# Altium project step_moter.PrjPcb
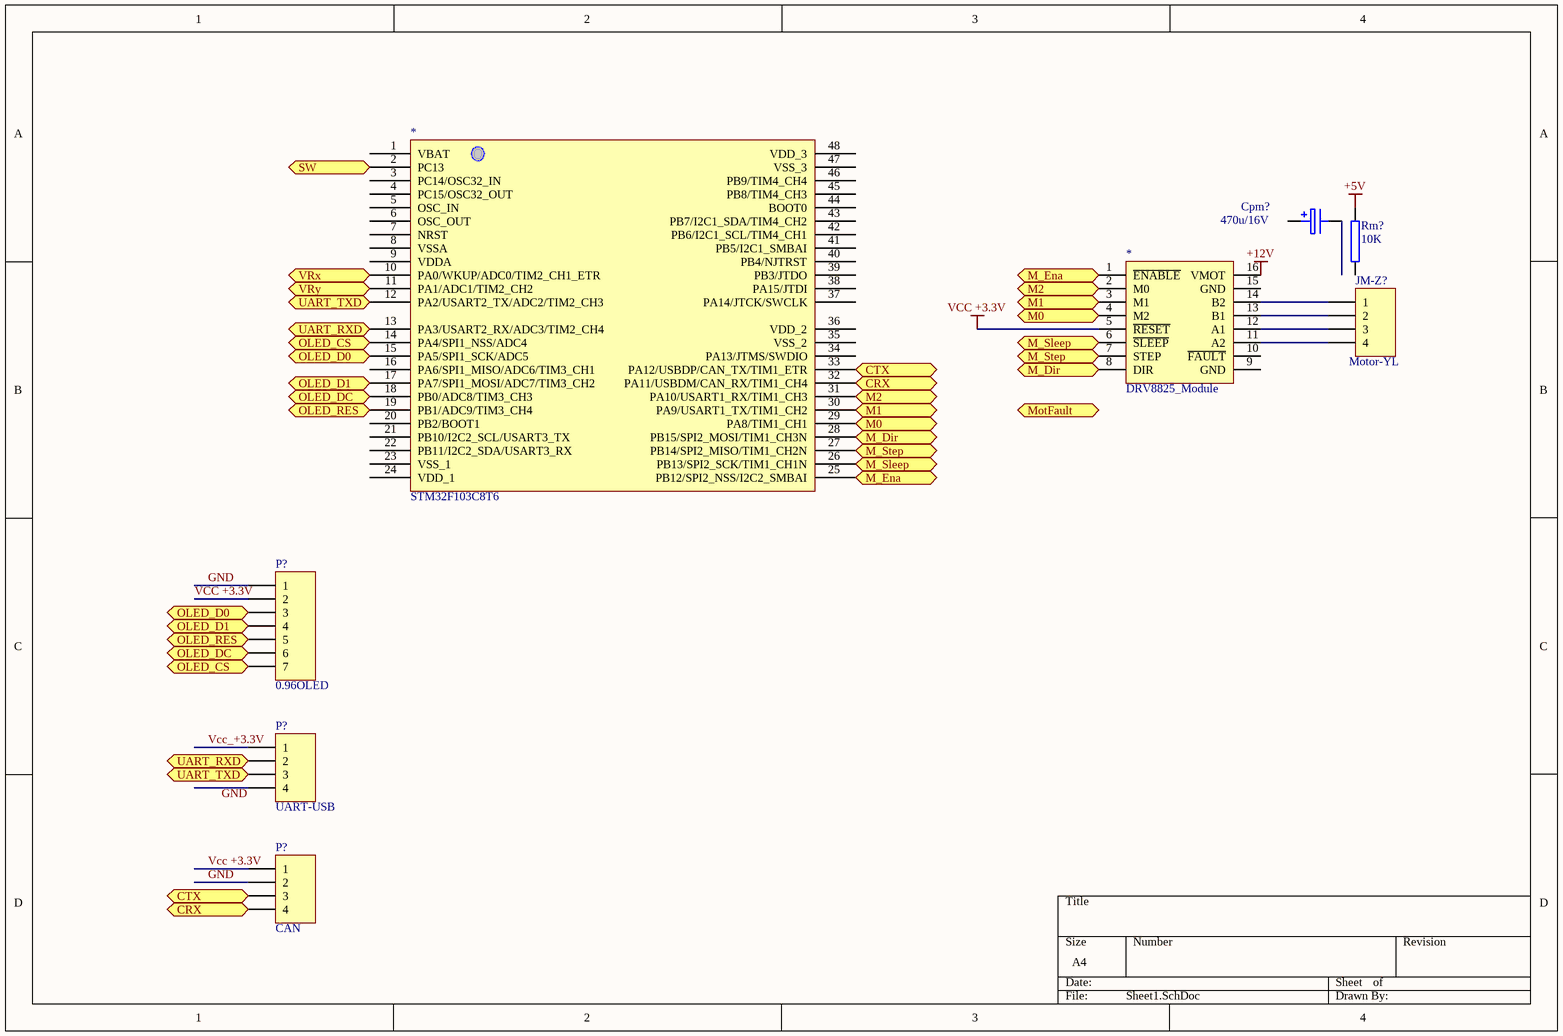
[diagram p0: Sheet1.SchDoc]
3 sheets, 135 parts. Net scope: flat (ports and power ports of the same name join across sheets).
Board files: V0.0.PcbDoc, V0.1.PcbDoc, ZJ-20251206.PcbDoc
Sheets:
  Sheet1.SchDoc
  V0.0.SchDoc
  V0.1.SchDoc

## Sheet Sheet1.SchDoc
size A4

### Parts
(Parts that share a designator on the sheet are numbered #1, #2 ... from top to bottom, then left to right.)
*#1  STM32F103C8T6
*#2  DRV8825_Module
Cpm?  470u/16V
JM-Z?  Motor-YL  [HDR1X4]
P?#1  0.96OLED  [HDR1X7]
P?#2  UART-USB  [HDR1X4]
P?#3  CAN  [HDR1X4]
Rm?  10K

### Ports
CRX (in), CRX (out), CTX (in), CTX (out), M0 (out), M1 (out), M2 (out), M_Dir (in), M_Dir (out), M_Ena (in), M_Ena (out), M_Sleep (in), M_Sleep (out), M_Step (in), M_Step (out), MotFault (out), OLED_CS (in), OLED_CS (out), OLED_D0 (in), OLED_D0 (out), OLED_D1 (in), OLED_D1 (out), OLED_DC (in), OLED_DC (out), OLED_RES (in), OLED_RES (out), SW (in), UART_RXD (in), UART_RXD (out), UART_TXD (in), UART_TXD (out), VRx (in), VRy (in)

### Nets
+5V: Rm?.1
+12V: *#2.16(VMOT)
VCC +3.3V: *#2.5(~{RESET}) P?#1.2 P?#3.1
GND: P?#1.1 P?#3.2
Vcc_+3.3V: P?#2.1
Net*#1_2: *#1.2(PC13) ; port SW
Net*#1_10: *#1.10(PA0/WKUP/ADC0/TIM2_CH1_ETR) ; port VRx
Net*#1_11: *#1.11(PA1/ADC1/TIM2_CH2) ; port VRy
Net*#1_12: *#1.12(PA2/USART2_TX/ADC2/TIM2_CH3) P?#2.3 ; port UART_TXD
Net*#1_13: *#1.13(PA3/USART2_RX/ADC3/TIM2_CH4) P?#2.2 ; port UART_RXD
Net*#1_14: *#1.14(PA4/SPI1_NSS/ADC4) P?#1.7 ; port OLED_CS
Net*#1_15: *#1.15(PA5/SPI1_SCK/ADC5) P?#1.3 ; port OLED_D0
Net*#1_17: *#1.17(PA7/SPI1_MOSI/ADC7/TIM3_CH2) P?#1.4 ; port OLED_D1
Net*#1_18: *#1.18(PB0/ADC8/TIM3_CH3) P?#1.6 ; port OLED_DC
Net*#1_19: *#1.19(PB1/ADC9/TIM3_CH4) P?#1.5 ; port OLED_RES
Net*#1_25: *#1.25(PB12/SPI2_NSS/I2C2_SMBAI) *#2.1(~{ENABLE}) ; port M_Ena
Net*#1_26: *#1.26(PB13/SPI2_SCK/TIM1_CH1N) *#2.6(~{SLEEP}) ; port M_Sleep
Net*#1_27: *#1.27(PB14/SPI2_MISO/TIM1_CH2N) *#2.7(STEP) ; port M_Step
Net*#1_28: *#1.28(PB15/SPI2_MOSI/TIM1_CH3N) *#2.8(DIR) ; port M_Dir
Net*#1_29: *#1.29(PA8/TIM1_CH1) *#2.4(M2) ; port M0
Net*#1_30: *#1.30(PA9/USART1_TX/TIM1_CH2) *#2.3(M1) ; port M1
Net*#1_31: *#1.31(PA10/USART1_RX/TIM1_CH3) *#2.2(M0) ; port M2
Net*#1_32: *#1.32(PA11/USBDM/CAN_RX/TIM1_CH4) P?#3.4 ; port CRX
Net*#1_33: *#1.33(PA12/USBDP/CAN_TX/TIM1_ETR) P?#3.3 ; port CTX
Net*#2_11: *#2.11(A2) JM-Z?.4
Net*#2_12: *#2.12(A1) JM-Z?.3
Net*#2_13: *#2.13(B1) JM-Z?.2
Net*#2_14: *#2.14(B2) JM-Z?.1

Not connected (* = marked no-connect by the designer): *#1 1(VBAT) 3(PC14/OSC32_IN) 4(PC15/OSC32_OUT) 5(OSC_IN) 6(OSC_OUT) 7(NRST) 8(VSSA) 9(VDDA) 16(PA6/SPI1_MISO/ADC6/TIM3_CH1) 20(PB2/BOOT1) 21(PB10/I2C2_SCL/USART3_TX) 22(PB11/I2C2_SDA/USART3_RX) 23(VSS_1) 24(VDD_1) 34(PA13/JTMS/SWDIO) 35(VSS_2) 36(VDD_2) 37(PA14/JTCK/SWCLK) 38(PA15/JTDI) 39(PB3/JTDO) 40(PB4/NJTRST) 41(PB5/I2C1_SMBAI) 42(PB6/I2C1_SCL/TIM4_CH1) 43(PB7/I2C1_SDA/TIM4_CH2) 44(BOOT0) 45(PB8/TIM4_CH3) 46(PB9/TIM4_CH4) 47(VSS_3) 48(VDD_3); *#2 9(GND) 10(~{FAULT}) 15(GND); Cpm? 1 2; P?#2 4; Rm? 2

### Notes on the sheet
- Labels drawn without touching a wire or pin: GND

### Library data of the parts
Cpm? = ELECTRO1: Electrolytic Capacitor
JM-Z? P?#2 P?#3 = Header 4: Header, 4-Pin; LatestRevisionDate: 17-Jul-2002; LatestRevisionNote: Re-released for DXP Platform.; Publisher: Altium Limited
P?#1 = Header 7: Header, 7-Pin; LatestRevisionDate: 17-Jul-2002; LatestRevisionNote: Re-released for DXP Platform.; Publisher: Altium Limited
Rm? = RES2

## Sheet V0.0.SchDoc
size A4
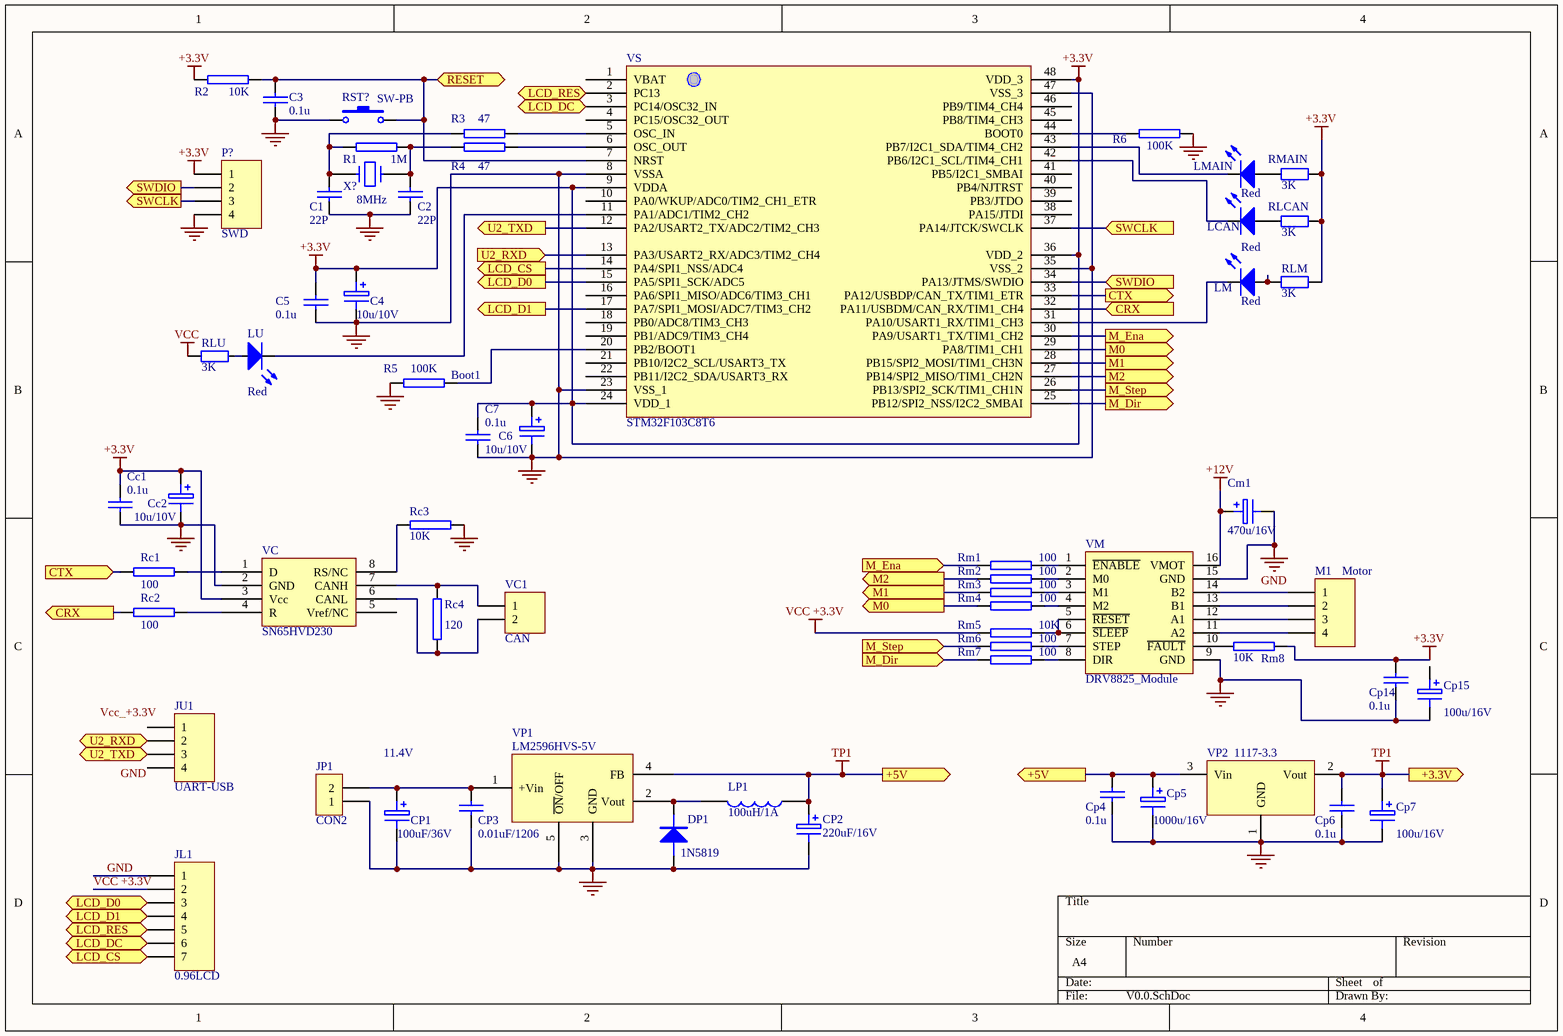
[diagram p1: V0.0.SchDoc]

### Parts
(Parts that share a designator on the sheet are numbered #1, #2 ... from top to bottom, then left to right.)
C1#1  22P
C2#1  22P
C3#1  0.1u
C4#1  10u/10V
C5#1  0.1u
C6#1  10u/10V
C7#1  0.1u
Cc1  0.1u
Cc2  10u/10V
Cm1  470u/16V
CP1  100uF/36V
CP2  220uF/16V
CP3  0.01uF/1206
Cp4  0.1u
Cp5  1000u/16V
Cp6  0.1u
Cp7  100u/16V
Cp14#1  0.1u
Cp15#1  100u/16V
DP1  1N5819
JL1  0.96LCD  [HDR1X7]
JP1  CON2
JU1  UART-USB  [HDR1X4]
LCAN  Red  [LED-0]
LM  Red  [LED-0]
LMAIN#1  Red  [LED-0]
LP1  100uH/1A
LU  Red  [LED-0]
M1  Motor  [HDR1X4]
P?#4  SWD  [HDR1X4]
R1#1  1M
R2#1  10K
R3#1  47
R4#1  47
R5#1  100K
R6#1  100K
Rc1#1  100
Rc2#1  100
Rc3#1  10K
Rc4#1  120
RLCAN  value 3K  [AXIAL-0.4]  (hidden comment: Res2)
RLM  value 3K  [AXIAL-0.4]  (hidden comment: Res2)
RLU  value 3K  [AXIAL-0.4]  (hidden comment: Res2)
Rm1#1  100
Rm2#1  100
Rm3#1  100
Rm4#1  100
Rm5#1  10K
Rm6#1  100
Rm7#1  100
Rm8#1  10K
RMAIN  value 3K  [AXIAL-0.4]  (hidden comment: Res2)
RST?  SW-PB  [SPST-2]
VC  SN65HVD230
VC1  CAN  [HDR1X2]
VM  DRV8825_Module
VP1  LM2596HVS-5V
VP2  1117-3.3
VS  STM32F103C8T6
X?  8MHz

### Ports
+3.3V, +5V (out), CRX (in), CRX (out), CTX (in), CTX (out), LCD_CS (in), LCD_CS (out), LCD_D0 (in), LCD_D0 (out), LCD_D1 (in), LCD_D1 (out), LCD_DC (in), LCD_DC (out), LCD_RES (in), LCD_RES (out), M0 (out), M1 (out), M2 (out), M_Dir (in), M_Dir (out), M_Ena (in), M_Ena (out), M_Step (in), M_Step (out), RESET, SWCLK (in), SWCLK (out), SWDIO (in), SWDIO (out), U2_RXD (in), U2_RXD (out), U2_TXD (in), U2_TXD (out)

### Nets
+3.3V: C4#1.1 C5#1.1 C6#1.1 C7#1.1 Cc1.1 Cc2.1 CP2.1 Cp4.1 Cp5.1 Cp6.1 Cp7.1 Cp14#1.1 LP1.1 P?#4.1 R2#1.2 RLCAN.1 RLM.1 Rm8#1.1 RMAIN.1 VC.3(Vcc) VP1.4(FB) VP2.2(Vout) VP2.3(Vin) VS.9(VDDA) VS.24(VDD_1) VS.36(VDD_2) VS.48(VDD_3) ; port +3.3V, port +5V  [also labelled TP1]
+12V: Cm1.1 VM.16(VMOT)
GND: C1#1.1 C2#1.1 C3#1.1 C4#1.2 C5#1.2 C6#1.2 C7#1.2 Cc1.2 Cc2.2 Cm1.2 Cp4.2 Cp5.2 Cp6.2 Cp7.2 JL1.1 P?#4.4 R5#1.2 R6#1.1 Rc3#1.2 RST?.1 VC.2(GND) VM.15(GND) VP2.1(GND) VS.8(VSSA) VS.23(VSS_1) VS.35(VSS_2) VS.47(VSS_3)
NetCp14#1_2: Cp14#1.2 Cp15#1.2 VM.9(GND)
VCC: CP1.2 CP2.2 CP3.2 DP1.1(A) JP1.1 RLU.2 VP1.3(GND) VP1.5(~{ON}/OFF)
VCC +3.3V: JL1.2 Rm5#1.1
Net*#1_25: Rm1#1.1 VS.30(PA9/USART1_TX/TIM1_CH2) ; port M_Ena
Net*#1_27: Rm6#1.1 VS.26(PB13/SPI2_SCK/TIM1_CH1N) ; port M_Step
Net*#1_28: Rm7#1.1 VS.25(PB12/SPI2_NSS/I2C2_SMBAI) ; port M_Dir
Net*#1_29: Rm4#1.1 VS.29(PA8/TIM1_CH1) ; port M0
Net*#1_30: Rm3#1.1 VS.28(PB15/SPI2_MOSI/TIM1_CH3N) ; port M1
Net*#1_31: Rm2#1.1 VS.27(PB14/SPI2_MISO/TIM1_CH2N) ; port M2
Net*#1_32: Rc2#1.1 VS.32(PA11/USBDM/CAN_RX/TIM1_CH4) ; port CRX
Net*#1_33: Rc1#1.1 VS.33(PA12/USBDP/CAN_TX/TIM1_ETR) ; port CTX
NetC1#1_2: C1#1.2 R1#1.2 R3#1.2 X?.1
NetC2#1_2: C2#1.2 R1#1.1 R4#1.2 X?.2
NetC3#1_2: C3#1.2 R2#1.1 RST?.2 VS.7(NRST) ; port RESET
NetCP1_1: CP1.1 CP3.1 JP1.2 VP1.1(+Vin)
NetDP1_2: DP1.2(K) LP1.2 VP1.2(Vout)
NetJL1_3: JL1.3 VS.15(PA5/SPI1_SCK/ADC5) ; port LCD_D0
NetJL1_4: JL1.4 VS.17(PA7/SPI1_MOSI/ADC7/TIM3_CH2) ; port LCD_D1
NetJL1_5: JL1.5 VS.2(PC13) ; port LCD_RES
NetJL1_6: JL1.6 VS.3(PC14/OSC32_IN) ; port LCD_DC
NetJL1_7: JL1.7 VS.14(PA4/SPI1_NSS/ADC4) ; port LCD_CS
NetJU1_2: JU1.2 VS.13(PA3/USART2_RX/ADC3/TIM2_CH4) ; port U2_RXD
NetJU1_3: JU1.3 VS.12(PA2/USART2_TX/ADC2/TIM2_CH3) ; port U2_TXD
NetLCAN_1: LCAN.1(A) RLCAN.2
NetLCAN_2: LCAN.2(K) VS.42(PB6/I2C1_SCL/TIM4_CH1)
NetLM_1: LM.1(A) RLM.2
NetLM_2: LM.2(K) VS.31(PA10/USART1_RX/TIM1_CH3)
NetLMAIN#1_1: LMAIN#1.1(A) RMAIN.2
NetLMAIN#1_2: LMAIN#1.2(K) VS.43(PB7/I2C1_SDA/TIM4_CH2)
NetLU_1: LU.1(A) RLU.1
NetLU_2: LU.2(K) VS.11(PA1/ADC1/TIM2_CH2)
NetM1_1: M1.1 VM.14(B2)
NetM1_2: M1.2 VM.13(B1)
NetM1_3: M1.3 VM.12(A1)
NetM1_4: M1.4 VM.11(A2)
NetP?#4_2: P?#4.2 VS.34(PA13/JTMS/SWDIO) ; port SWDIO
NetP?#4_3: P?#4.3 VS.37(PA14/JTCK/SWCLK) ; port SWCLK
NetR3#1_1: R3#1.1 VS.5(OSC_IN)
NetR4#1_1: R4#1.1 VS.6(OSC_OUT)
NetR5#1_1: R5#1.1 VS.20(PB2/BOOT1)
NetR6#1_2: R6#1.2 VS.44(BOOT0)
NetRc1#1_2: Rc1#1.2 VC.1(D)
NetRc2#1_2: Rc2#1.2 VC.4(R)
NetRc3#1_1: Rc3#1.1 VC.8(RS/NC)
NetRc4#1_1: Rc4#1.1 VC.7(CANH) VC1.1
NetRc4#1_2: Rc4#1.2 VC.6(CANL) VC1.2
NetRm1#1_2: Rm1#1.2 VM.1(~{ENABLE})
NetRm2#1_2: Rm2#1.2 VM.2(M0)
NetRm3#1_2: Rm3#1.2 VM.3(M1)
NetRm4#1_2: Rm4#1.2 VM.4(M2)
NetRm5#1_2: Rm5#1.2 VM.5(~{RESET}) VM.6(~{SLEEP})
NetRm6#1_2: Rm6#1.2 VM.7(STEP)
NetRm7#1_2: Rm7#1.2 VM.8(DIR)
NetRm8#1_2: Rm8#1.2 VM.10(~{FAULT})

Not connected (* = marked no-connect by the designer): Cp15#1 1; JU1 1 4; VC 5(Vref/NC); VS 1(VBAT) 4(PC15/OSC32_OUT) 10(PA0/WKUP/ADC0/TIM2_CH1_ETR) 16(PA6/SPI1_MISO/ADC6/TIM3_CH1) 18(PB0/ADC8/TIM3_CH3) 19(PB1/ADC9/TIM3_CH4) 21(PB10/I2C2_SCL/USART3_TX) 22(PB11/I2C2_SDA/USART3_RX) 38(PA15/JTDI) 39(PB3/JTDO) 40(PB4/NJTRST) 41(PB5/I2C1_SMBAI) 45(PB8/TIM4_CH3) 46(PB9/TIM4_CH4)

### Notes on the sheet
- (near R5#1) Boot1
- 11.4V
- Labels drawn without touching a wire or pin: GND, Vcc_+3.3V

### Library data of the parts
C1#1 C2#1 C3#1 C5#1 C7#1 Cc1 CP3 Cp4 Cp6 Cp14#1 = CAP: Capacitor
C4#1 C6#1 Cc2 Cm1 CP1 CP2 Cp5 Cp7 Cp15#1 = ELECTRO1: Electrolytic Capacitor
DP1 = DIODE
JL1 = Header 7: Header, 7-Pin; LatestRevisionDate: 17-Jul-2002; LatestRevisionNote: Re-released for DXP Platform.; Publisher: Altium Limited
JP1 = CON2: Connector
JU1 M1 P?#4 = Header 4: Header, 4-Pin; LatestRevisionDate: 17-Jul-2002; LatestRevisionNote: Re-released for DXP Platform.; Publisher: Altium Limited
LCAN LM LMAIN#1 LU = LED0: Typical INFRARED GaAs LED; Published: 8-Jun-2000; LatestRevisionDate: 08-Jul-2005; LatestRevisionNote: Mech Layer 1 removed.; PackageReference: LED-0; Publisher: Altium Limited
LP1 = INDUCTOR1
R1#1 R2#1 R3#1 R4#1 R5#1 R6#1 Rc1#1 Rc2#1 Rc3#1 Rc4#1 Rm1#1 Rm2#1 Rm3#1 Rm4#1 Rm5#1 Rm6#1 Rm7#1 Rm8#1 = RES2
RLCAN RLM RLU RMAIN = Res2: Resistor; Published: 8-Jun-2000; LatestRevisionDate: 17-Jul-2002; LatestRevisionNote: Re-released for DXP Platform.; PackageReference: AXIAL-0.4; Publisher: Altium Limited
RST? = SW-PB: Switch; Published: 24-Mar-1999; LatestRevisionDate: 17-Jul-2002; LatestRevisionNote: Re-released for DXP Platform.; PackageReference: SPST-2; Publisher: Altium Limited
VC1 = Header 2: Header, 2-Pin; LatestRevisionDate: 17-Jul-2002; LatestRevisionNote: Re-released for DXP Platform.; Publisher: Altium Limited
X? = CRYSTAL

## Sheet V0.1.SchDoc
size A3
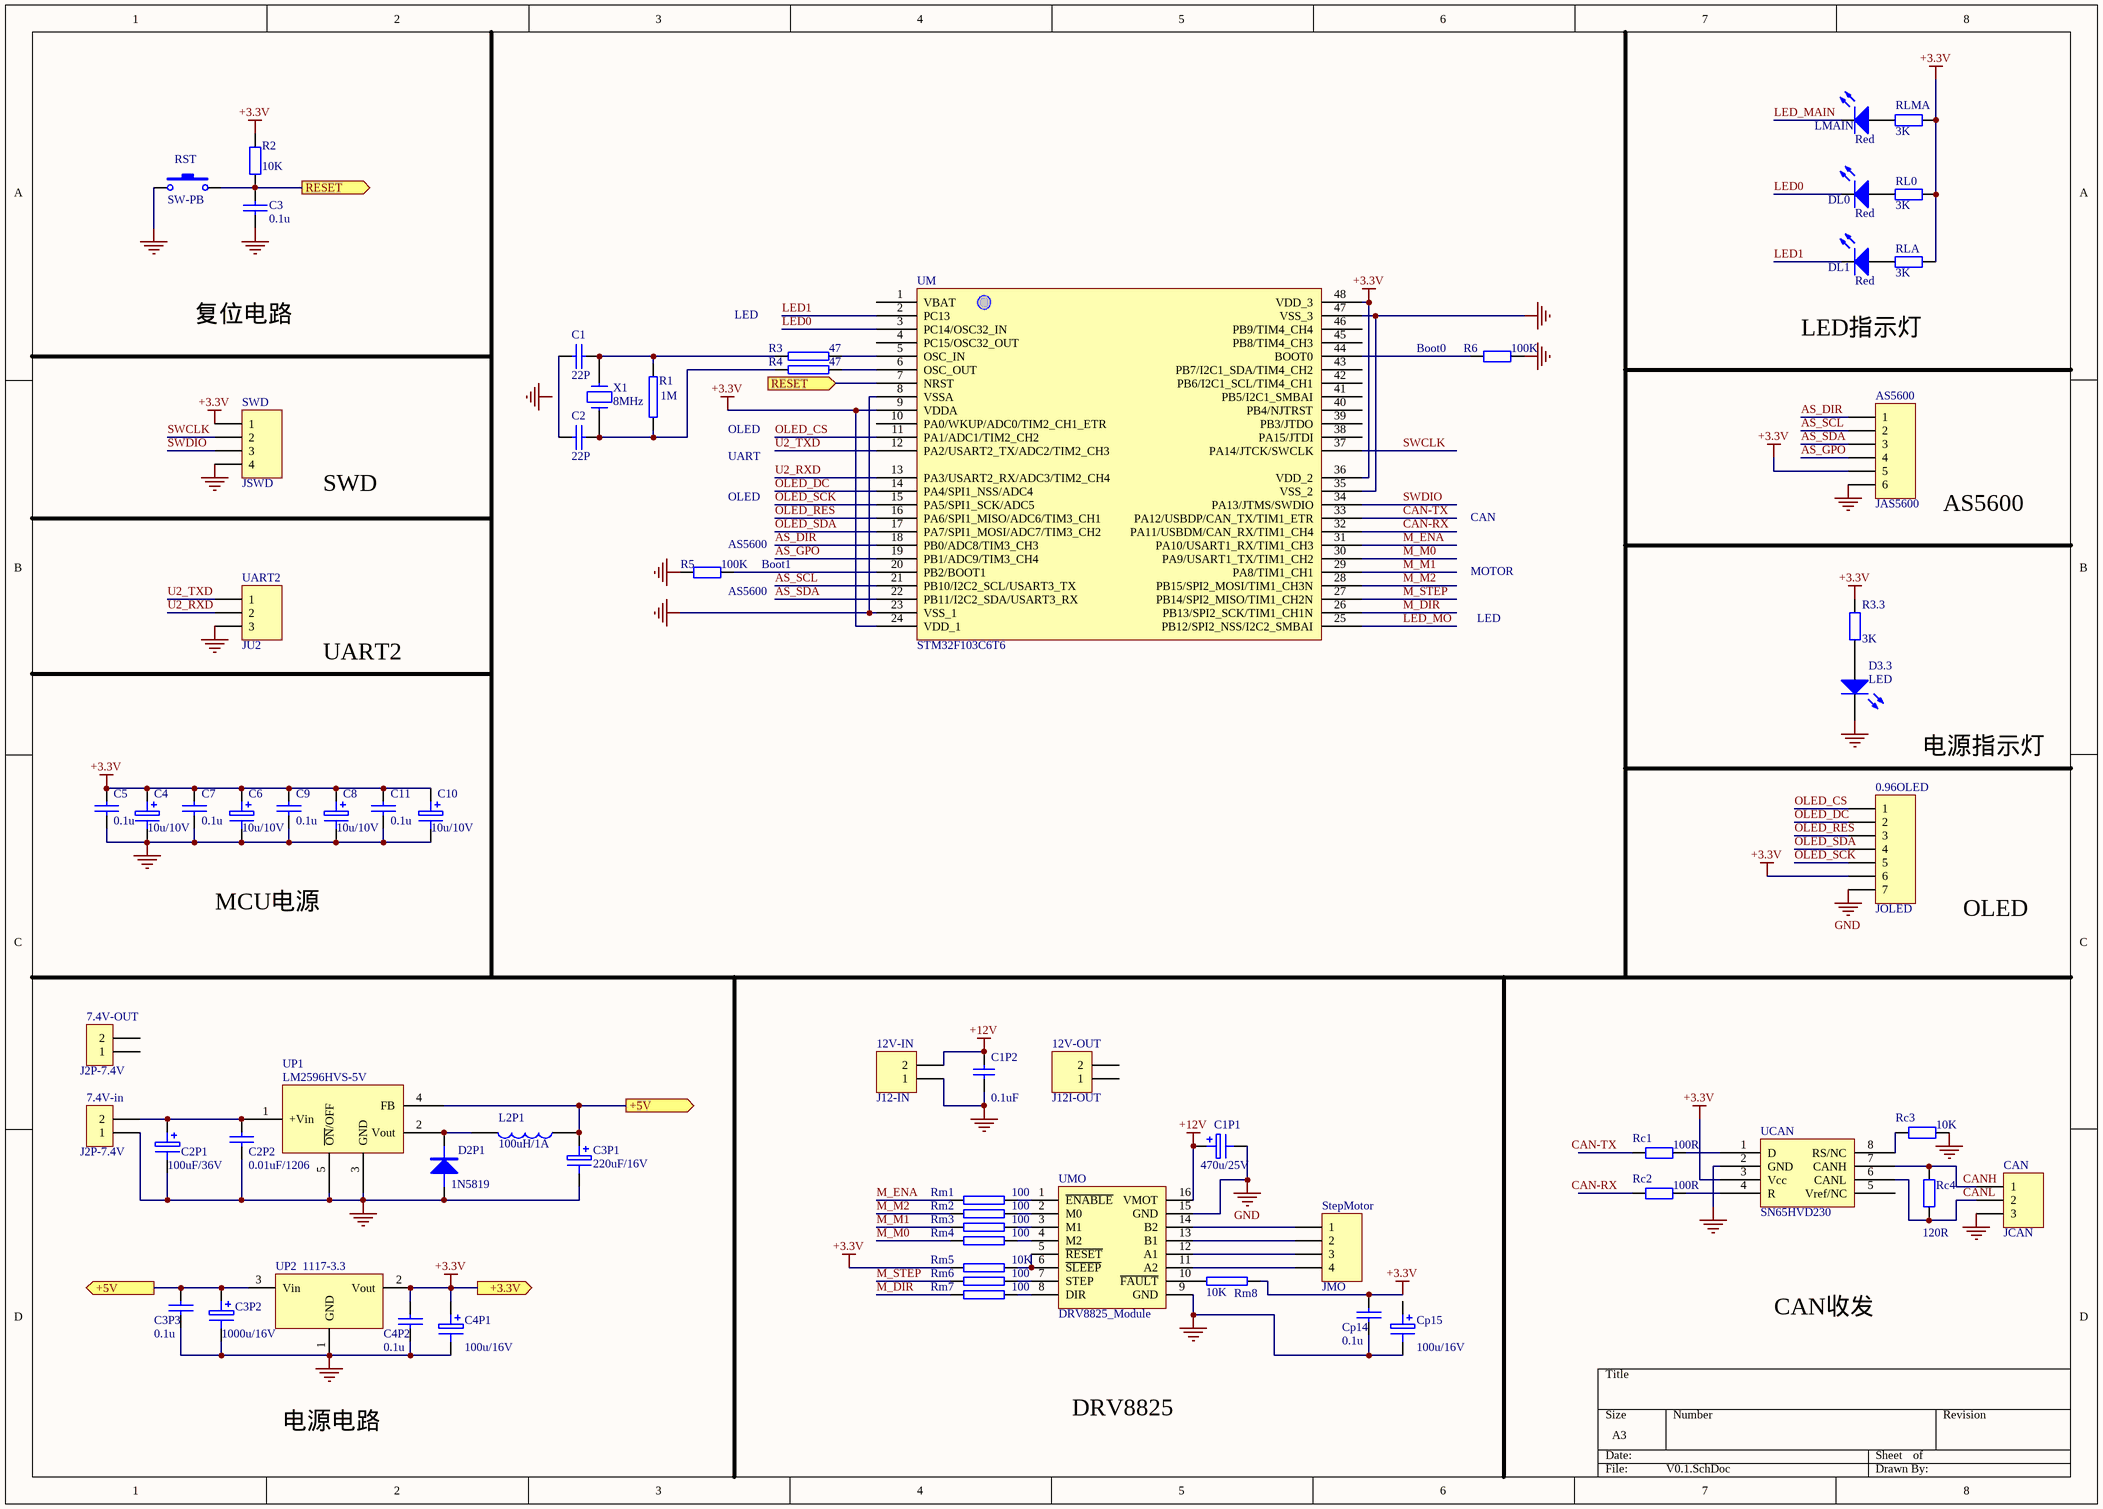
[diagram p2: V0.1.SchDoc]

### Parts
(Parts that share a designator on the sheet are numbered #1, #2 ... from top to bottom, then left to right.)
0.96OLED  JOLED  [HDR1X7]
7.4V-in  J2P-7.4V
7.4V-OUT  J2P-7.4V
12V-IN  J12-IN  [HDR1X2]
12V-OUT  J12I-OUT  [HDR1X2]
AS5600  JAS5600  [HDR1X6]
C1#2  22P
C1P1  470u/25V
C1P2  value 0.1uF  [C1206]  (hidden comment: Cap Semi)
C2#2  22P
C2P1  100uF/36V
C2P2  0.01uF/1206
C3#2  0.1u
C3P1  220uF/16V
C3P2  1000u/16V
C3P3  0.1u
C4#2  10u/10V
C4P1  100u/16V
C4P2  0.1u
C5#2  0.1u
C6#2  10u/10V
C7#2  0.1u
C8  10u/10V
C9  0.1u
C10  10u/10V
C11  0.1u
CAN  JCAN  [HDR1X3]
Cp14#2  0.1u
Cp15#2  100u/16V
D2P1  1N5819
D3.3  LED  [3.2X1.6X1.1]
DL0  Red  [LED-0]
DL1  Red  [LED-0]
L2P1  100uH/1A
LMAIN#2  Red  [LED-0]
R1#2  1M
R2#2  10K  [AXIAL-0.4]
R3#2  47
R3.3  value 3K  [AXIAL-0.4]  (hidden comment: Res2)
R4#2  47
R5#2  value 100K  [AXIAL-0.4]  (hidden comment: Res2)
R6#2  value 100K  [AXIAL-0.4]  (hidden comment: Res2)
Rc1#2  value 100R  [AXIAL-0.4]  (hidden comment: Res2)
Rc2#2  value 100R  [AXIAL-0.4]  (hidden comment: Res2)
Rc3#2  value 10K  [AXIAL-0.4]  (hidden comment: Res2)
Rc4#2  value 120R  [AXIAL-0.4]  (hidden comment: Res2)
RL0  value 3K  [AXIAL-0.4]  (hidden comment: Res2)
RLA  value 3K  [AXIAL-0.4]  (hidden comment: Res2)
RLMA  value 3K  [AXIAL-0.4]  (hidden comment: Res2)
Rm1#2  100
Rm2#2  100
Rm3#2  100
Rm4#2  100
Rm5#2  10K
Rm6#2  100
Rm7#2  100
Rm8#2  10K
RST  SW-PB  [SPST-2]
StepMotor  JMO  [HDR1X4]
SWD  JSWD  [HDR1X4]
UART2  JU2  [HDR1X3]
UCAN  SN65HVD230
UM  STM32F103C6T6
UMO  DRV8825_Module
UP1  LM2596HVS-5V
UP2  1117-3.3
X1  8MHz

### Ports
+3.3V, +5V (out), RESET (in), RESET (out)

### Nets
+3.3V: 0.96OLED.6 AS5600.5 C3P1.1 C3P2.1 C3P3.1 C4#2.1 C4P1.1 C4P2.1 C5#2.2 C6#2.1 C7#2.1 C8.1 C9.1 C10.1 C11.1 Cp14#2.1 L2P1.1 R2#2.2 R3.3.2 RL0.1 RLA.1 RLMA.1 Rm5#2.1 Rm8#2.1 SWD.1 UCAN.3(Vcc) UM.9(VDDA) UM.24(VDD_1) UM.36(VDD_2) UM.48(VDD_3) UP1.4(FB) UP2.2(Vout) UP2.3(Vin) ; port +3.3V, port +5V
+12V: 12V-IN.2 C1P1.1 C1P2.2 UMO.16(VMOT)
GND: 0.96OLED.7 12V-IN.1 AS5600.6 C1P1.2 C1P2.1 C3#2.1 C3P2.2 C3P3.2 C4#2.2 C4P1.2 C4P2.2 C5#2.1 C6#2.2 C7#2.2 C8.2 C9.2 C10.2 C11.2 CAN.3 D3.3.2(K) R5#2.1 R6#2.2 Rc3#2.1 SWD.4 UART2.3 UCAN.2(GND) UM.8(VSSA) UM.23(VSS_1) UM.35(VSS_2) UM.47(VSS_3) UMO.15(GND) UP2.1(GND)
NetCp14#1_2: Cp14#2.2 Cp15#2.2 RST.1 UMO.9(GND)
VCC: 7.4V-in.1 C2P1.2 C2P2.2 C3P1.2 D2P1.1(A) UP1.3(GND) UP1.5(~{ON}/OFF)
AS_DIR: AS5600.1 UM.18(PB0/ADC8/TIM3_CH3)
AS_GPO: AS5600.4 UM.19(PB1/ADC9/TIM3_CH4)
AS_SCL: AS5600.2 UM.21(PB10/I2C2_SCL/USART3_TX)
AS_SDA: AS5600.3 UM.22(PB11/I2C2_SDA/USART3_RX)
CAN-RX: UM.32(PA11/USBDM/CAN_RX/TIM1_CH4)
CAN-TX: UM.33(PA12/USBDP/CAN_TX/TIM1_ETR)
CANH: CAN.1 Rc4#2.2 UCAN.7(CANH)
CANL: CAN.2 Rc4#2.1 UCAN.6(CANL)
LED0: DL0.2(K) UM.3(PC14/OSC32_IN)
LED1: DL1.2(K) UM.2(PC13)
LED_MAIN: LMAIN#2.2(K)
LED_MO: UM.25(PB12/SPI2_NSS/I2C2_SMBAI)
M_DIR: Rm7#2.1 UM.26(PB13/SPI2_SCK/TIM1_CH1N)
M_ENA: Rm1#2.1 UM.31(PA10/USART1_RX/TIM1_CH3)
M_M0: Rm4#2.1 UM.30(PA9/USART1_TX/TIM1_CH2)
M_M1: Rm3#2.1 UM.29(PA8/TIM1_CH1)
M_M2: Rm2#2.1 UM.28(PB15/SPI2_MOSI/TIM1_CH3N)
M_STEP: Rm6#2.1 UM.27(PB14/SPI2_MISO/TIM1_CH2N)
OLED_CS: 0.96OLED.1 UM.11(PA1/ADC1/TIM2_CH2)
OLED_DC: 0.96OLED.2 UM.14(PA4/SPI1_NSS/ADC4)
OLED_RES: 0.96OLED.3 UM.16(PA6/SPI1_MISO/ADC6/TIM3_CH1)
OLED_SCK: 0.96OLED.5 UM.15(PA5/SPI1_SCK/ADC5)
OLED_SDA: 0.96OLED.4 UM.17(PA7/SPI1_MOSI/ADC7/TIM3_CH2)
SWCLK: SWD.2 UM.37(PA14/JTCK/SWCLK)
SWDIO: SWD.3 UM.34(PA13/JTMS/SWDIO)
U2_RXD: UART2.2 UM.13(PA3/USART2_RX/ADC3/TIM2_CH4)
U2_TXD: UART2.1 UM.12(PA2/USART2_TX/ADC2/TIM2_CH3)
Net7.4V-in_2: 7.4V-in.2 C2P1.1 C2P2.1 UP1.1(+Vin)
NetC1#2_1: C1#2.1 R1#2.1 R3#2.2 X1.2
NetC1#2_2: C1#2.2 C2#2.2
NetC2#2_1: C2#2.1 R1#2.2 R4#2.2 X1.1
NetC3#1_2: C3#2.2 R2#2.1 RST.2 UM.7(NRST) ; port RESET
NetD2P1_2: D2P1.2(K) L2P1.2 UP1.2(Vout)
NetD3.3_1: D3.3.1(A) R3.3.1
NetDL0_1: DL0.1(A) RL0.2
NetDL1_1: DL1.1(A) RLA.2
NetLMAIN#2_1: LMAIN#2.1(A) RLMA.2
NetR3#2_1: R3#2.1 UM.5(OSC_IN)
NetR4#2_1: R4#2.1 UM.6(OSC_OUT)
NetR5#2_2: R5#2.2 UM.20(PB2/BOOT1)
NetR6#2_1: R6#2.1 UM.44(BOOT0)
NetRc1#2_1: Rc1#2.1 UCAN.1(D)
NetRc2#2_1: Rc2#2.1 UCAN.4(R)
NetRc3#2_2: Rc3#2.2 UCAN.8(RS/NC)
NetRm1#2_2: Rm1#2.2 UMO.1(~{ENABLE})
NetRm2#2_2: Rm2#2.2 UMO.2(M0)
NetRm3#2_2: Rm3#2.2 UMO.3(M1)
NetRm4#2_2: Rm4#2.2 UMO.4(M2)
NetRm5#2_2: Rm5#2.2 UMO.5(~{RESET}) UMO.6(~{SLEEP})
NetRm6#2_2: Rm6#2.2 UMO.7(STEP)
NetRm7#2_2: Rm7#2.2 UMO.8(DIR)
NetRm8#2_2: Rm8#2.2 UMO.10(~{FAULT})
NetStepMotor_1: StepMotor.1 UMO.14(B2)
NetStepMotor_2: StepMotor.2 UMO.13(B1)
NetStepMotor_3: StepMotor.3 UMO.12(A1)
NetStepMotor_4: StepMotor.4 UMO.11(A2)

Not connected (* = marked no-connect by the designer): 7.4V-OUT 1 2; 12V-OUT 1 2; Cp15#2 1; Rc1#2 2; Rc2#2 2; UCAN 5(Vref/NC); UM 1(VBAT) 4(PC15/OSC32_OUT) 10(PA0/WKUP/ADC0/TIM2_CH1_ETR) 38(PA15/JTDI) 39(PB3/JTDO) 40(PB4/NJTRST) 41(PB5/I2C1_SMBAI) 42(PB6/I2C1_SCL/TIM4_CH1) 43(PB7/I2C1_SDA/TIM4_CH2) 45(PB8/TIM4_CH3) 46(PB9/TIM4_CH4)

### Notes on the sheet
- LED
- 复位电路
- (near R6#2) Boot0
- LED指示灯
- OLED
- SWD
- UART
- AS5600
- (near R5#2) AS5600
- (near R5#2) Boot1
- CAN
- MOTOR
- UART2
- 电源指示灯
- MCU电源
- CAN收发
- 电源电路
- DRV8825
- Labels drawn without touching a wire or pin: CAN-RX, CAN-TX, GND

### Library data of the parts
0.96OLED = Header 7: Header, 7-Pin; LatestRevisionDate: 17-Jul-2002; LatestRevisionNote: Re-released for DXP Platform.; Publisher: Altium Limited
7.4V-in 7.4V-OUT = CON2: Connector
12V-IN 12V-OUT = Header 2: Header, 2-Pin; LatestRevisionDate: 17-Jul-2002; LatestRevisionNote: Re-released for DXP Platform.; Publisher: Altium Limited
AS5600 = Header 6: Header, 6-Pin; LatestRevisionDate: 17-Jul-2002; LatestRevisionNote: Re-released for DXP Platform.; Publisher: Altium Limited
C1#2 C2#2 C2P2 C3#2 C3P3 C4P2 C5#2 C7#2 C9 C11 Cp14#2 = CAP: Capacitor
C1P1 C2P1 C3P1 C3P2 C4#2 C4P1 C6#2 C8 C10 Cp15#2 = ELECTRO1: Electrolytic Capacitor
C1P2 = Cap Semi: Capacitor (Semiconductor SIM Model); Published: 8-Jun-2000; LatestRevisionDate: 29-May-2009; LatestRevisionNote: IPC-7351 Footprint Added.; PackageReference: C1206; Publisher: Altium Limited; PackageDescription: Chip Capacitor
CAN UART2 = Header 3: Header, 3-Pin; LatestRevisionDate: 17-Jul-2002; LatestRevisionNote: Re-released for DXP Platform.; Publisher: Altium Limited
D2P1 = DIODE
D3.3 = LED2: Typical RED, GREEN, YELLOW, AMBER GaAs LED; Published: 8-Jun-2000; LatestRevisionDate: 17-Jul-2002; LatestRevisionNote: Re-released for DXP Platform.; PackageVersion: Feb-2002; PackageReference: 3.2X1.6X1.1; Publisher: Altium Limited; PackageDescription: SM LED; 2 Flat Leads
DL0 DL1 LMAIN#2 = LED0: Typical INFRARED GaAs LED; Published: 8-Jun-2000; LatestRevisionDate: 08-Jul-2005; LatestRevisionNote: Mech Layer 1 removed.; PackageReference: LED-0; Publisher: Altium Limited
L2P1 = INDUCTOR1
R1#2 R3#2 R4#2 Rm1#2 Rm2#2 Rm3#2 Rm4#2 Rm5#2 Rm6#2 Rm7#2 Rm8#2 = RES2
R2#2 R3.3 R5#2 R6#2 Rc1#2 Rc2#2 Rc3#2 Rc4#2 RL0 RLA RLMA = Res2: Resistor; Published: 8-Jun-2000; LatestRevisionDate: 17-Jul-2002; LatestRevisionNote: Re-released for DXP Platform.; PackageReference: AXIAL-0.4; Publisher: Altium Limited
  R2#2: PackageDescription: Axial Device, Thru-Hole; 2 Leads; 0.4 in Pin Spacing; Value: 10K
  R3.3 R5#2 R6#2 Rc1#2 Rc2#2 Rc3#2 Rc4#2: PackageDescription: Axial Device, Thru-Hole; 2 Leads; 0.4 in Pin Spacing
RST = SW-PB: Switch; Published: 24-Mar-1999; LatestRevisionDate: 17-Jul-2002; LatestRevisionNote: Re-released for DXP Platform.; PackageReference: SPST-2; Publisher: Altium Limited
StepMotor SWD = Header 4: Header, 4-Pin; LatestRevisionDate: 17-Jul-2002; LatestRevisionNote: Re-released for DXP Platform.; Publisher: Altium Limited
UM = STM32F103C8T6
X1 = CRYSTAL

## Nets that join several sheets
+3.3V: V0.0 (27 pins), V0.1 (33 pins)
+12V: Sheet1 (*#2.16), V0.0 (Cm1.1 VM.16), V0.1 (12V-IN.2 C1P1.1 C1P2.2 UMO.16)
GND: V0.0 (27 pins), V0.1 (32 pins)
NetCp14#1_2: V0.0 (Cp14#1.2 Cp15#1.2 VM.9), V0.1 (Cp14#2.2 Cp15#2.2 RST.1 UMO.9)
VCC: V0.0 (8 pins), V0.1 (7 pins)
VCC +3.3V: Sheet1 (*#2.5 P?#1.2 P?#3.1), V0.0 (JL1.2 Rm5#1.1)
Net*#1_25: Sheet1 (*#1.25 *#2.1), V0.0 (Rm1#1.1 VS.30)
Net*#1_27: Sheet1 (*#1.27 *#2.7), V0.0 (Rm6#1.1 VS.26)
Net*#1_28: Sheet1 (*#1.28 *#2.8), V0.0 (Rm7#1.1 VS.25)
Net*#1_29: Sheet1 (*#1.29 *#2.4), V0.0 (Rm4#1.1 VS.29)
Net*#1_30: Sheet1 (*#1.30 *#2.3), V0.0 (Rm3#1.1 VS.28)
Net*#1_31: Sheet1 (*#1.31 *#2.2), V0.0 (Rm2#1.1 VS.27)
Net*#1_32: Sheet1 (*#1.32 P?#3.4), V0.0 (Rc2#1.1 VS.32)
Net*#1_33: Sheet1 (*#1.33 P?#3.3), V0.0 (Rc1#1.1 VS.33)
NetC3#1_2: V0.0 (C3#1.2 R2#1.1 RST?.2 VS.7), V0.1 (C3#2.2 R2#2.1 RST.2 UM.7)